# EasyEDA Pro project AD630锁相放大器.eprj

# Schematic Schematic1
Board Name: Board1; Create Date: 2025-03-01; Page Name: P1; Project Name: AD630锁相放大器; Schematic Name: Schematic1; Update Date: 2025-03-07; Company: 嘉立创EDA; Page Size: A4; Version: V1.0
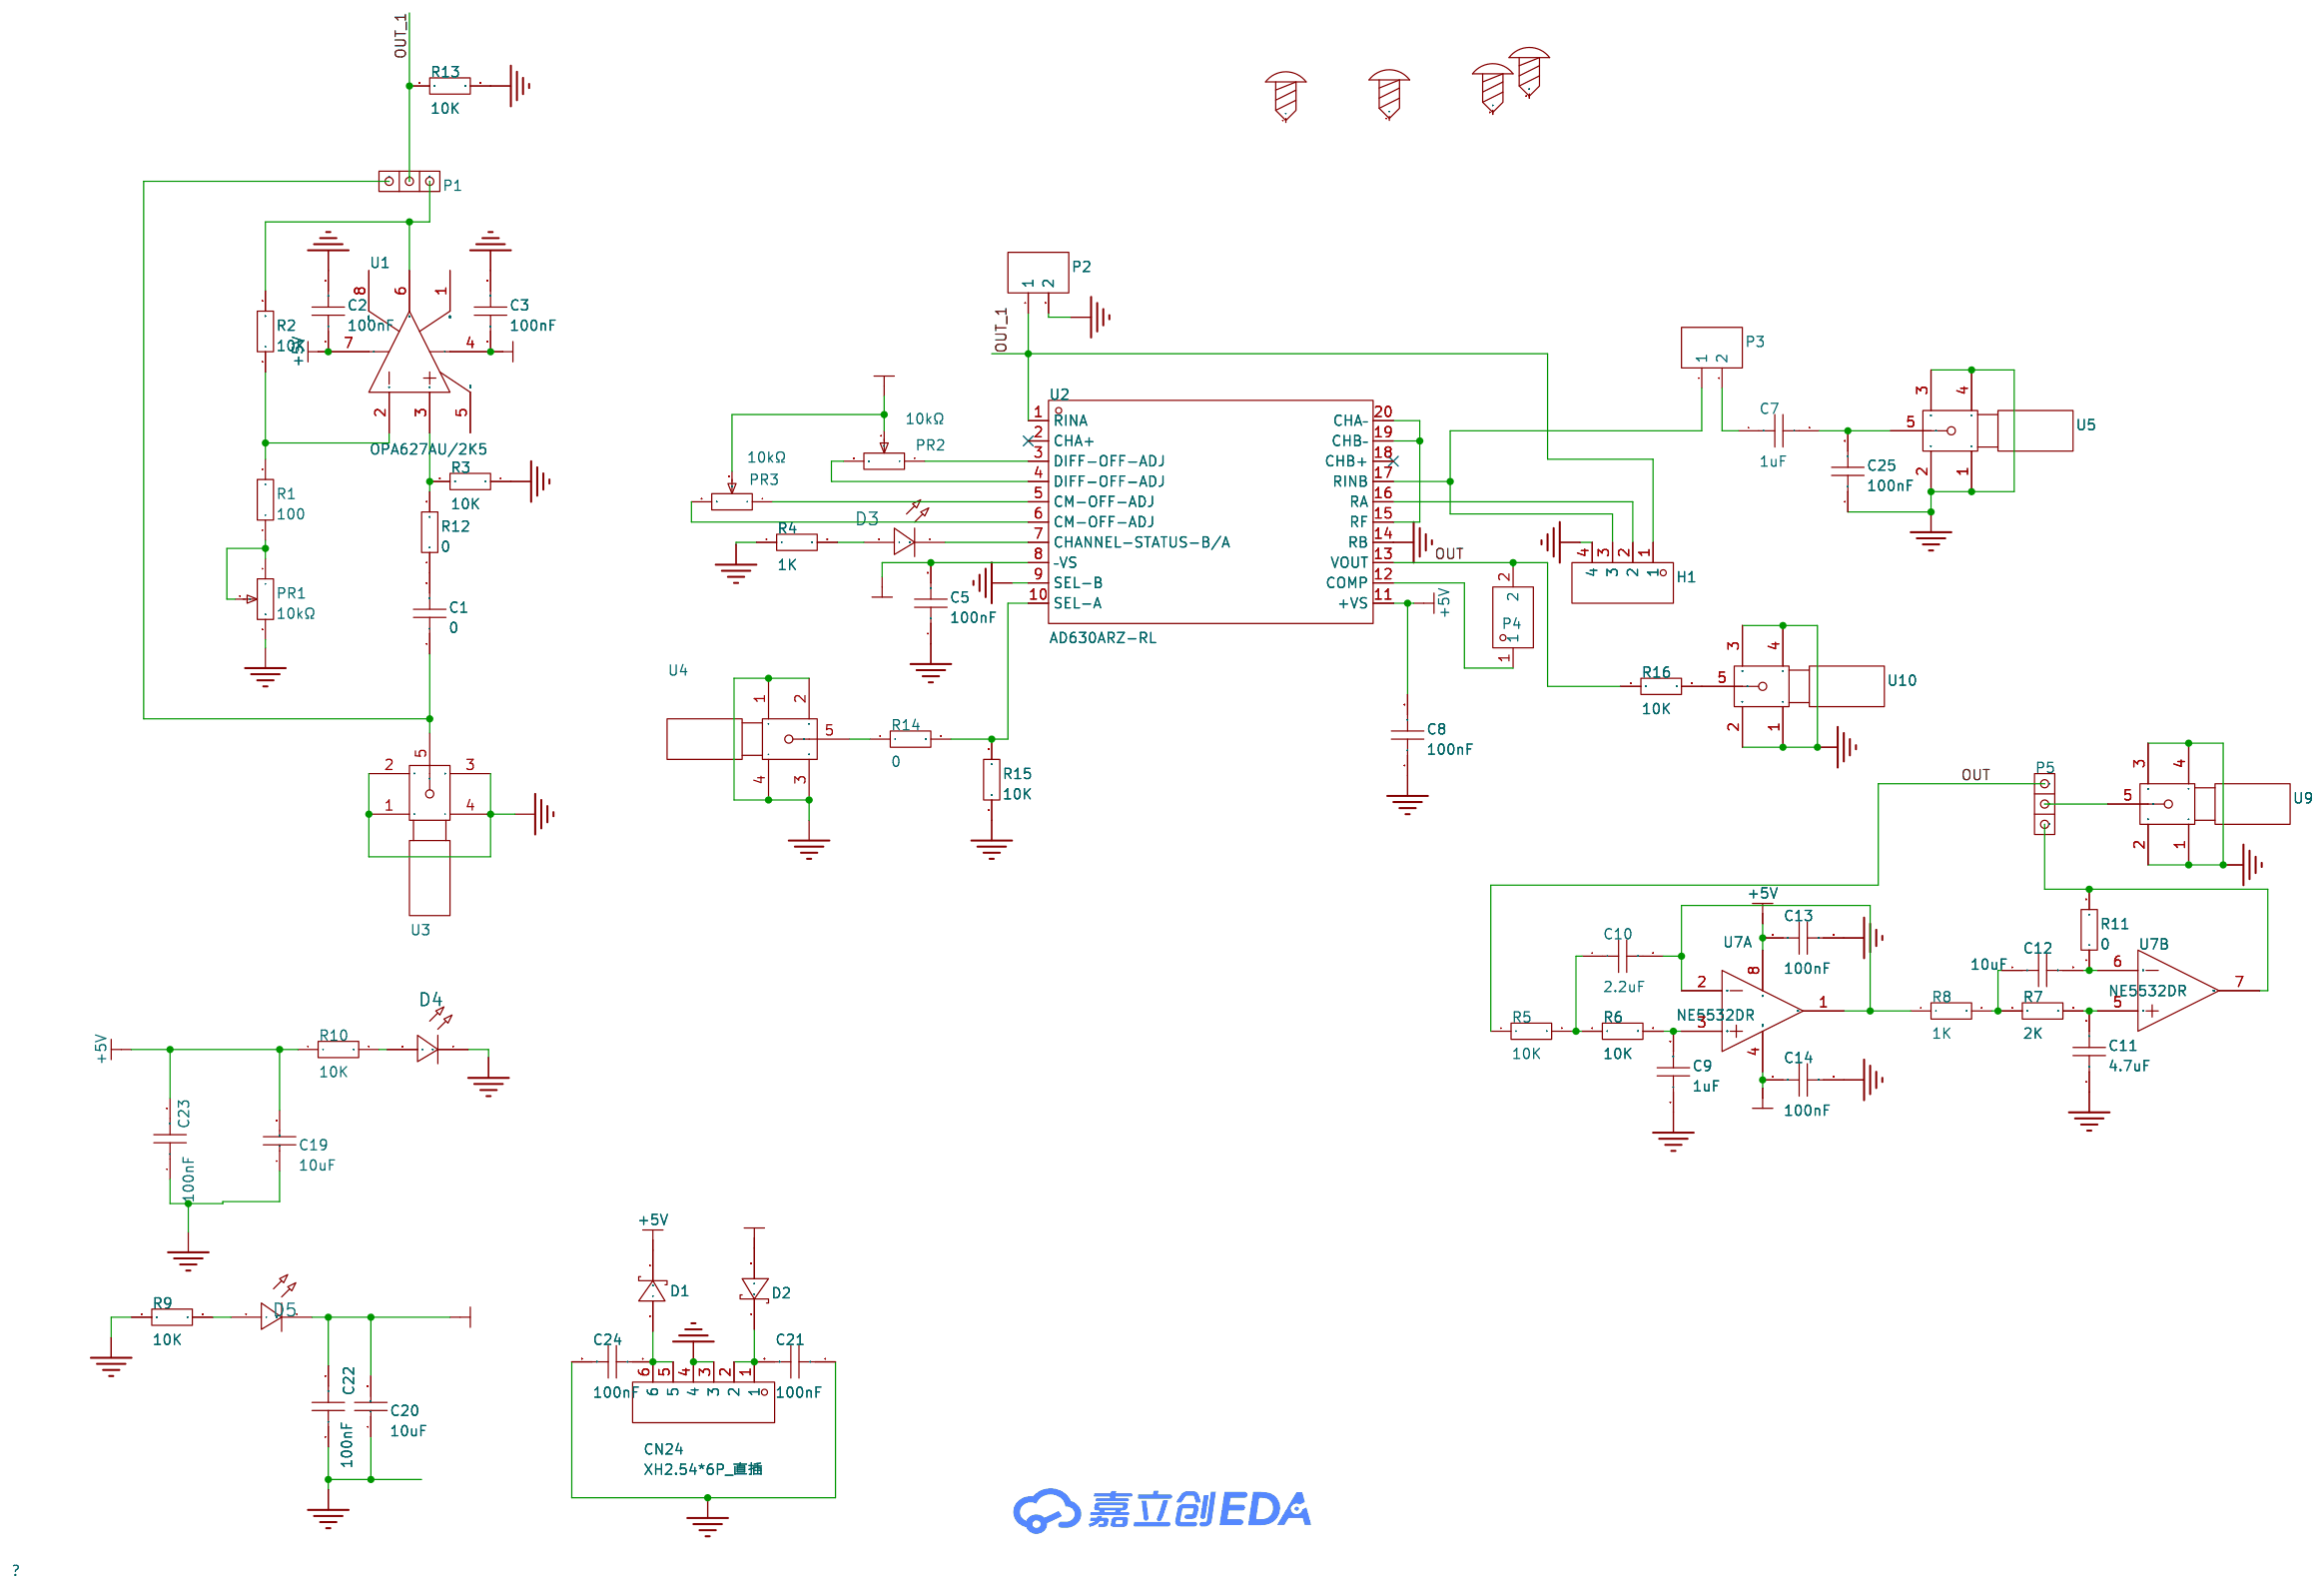
[diagram p0: schematic sheet]

## Parts
C1  0  [R0805]
C2  100nF  [R0805]
C3  100nF  [R0805]
C5  100nF  [R0805]
C7  1uF  [R0805]
C8  100nF  [R0805]
C9  1uF  [R0805]
C10  2.2uF  [R0805]
C11  4.7uF  [R0805]
C12  10uF  [R0805]
C13  100nF  [R0805]
C14  100nF  [R0805]
C19  10uF  [C1210]
C20  10uF  [C1210]
C21  100nF  [R0805]
C22  100nF  [R0805]
C23  100nF  [R0805]
C24  100nF  [R0805]
C25  100nF  [R0805]
CN24  XH2.54*6P_直插  [CONN-TH_XH2.54-6P]
D1  SD103AWS  [SOD-323_L1.8-W1.3-LS2.5-RD]
D2  SD103AWS  [SOD-323_L1.8-W1.3-LS2.5-RD]
D3  -  [LED_0805]
D4  -  [LED_0805]
D5  -  [LED_0805]
H1  -  [HDR-TH_4P-P2.54-V-M]
P1  -  [1*3跳线]
P2  -  [HDR-TH_2P-P2.54-V-F]
P3  -  [HDR-TH_2P-P2.54-V-F]
P4  -  [HDR-TH_2P-P2.54-V-M-2]
P5  -  [1*3跳线]
PR1  10kΩ  [R_3296]
PR2  10kΩ  [R_3296]
PR3  10kΩ  [R_3296]
R1  100  [R0805]
R2  10K  [R0805]
R3  10K  [R0805]
R4  1K  [R0805]
R5  10K  [R0805]
R6  10K  [R0805]
R7  2K  [R0805]
R8  1K  [R0805]
R9  10K  [R0805]
R10  10K  [R0805]
R11  0  [R0805]
R12  0  [R0805]
R13  10K  [R0805]
R14  0  [R0805]
R15  10K  [R0805]
R16  10K  [R0805]
SCREW1  -  [M3螺丝]
SCREW2  -  [M3螺丝]
SCREW3  -  [M3螺丝]
SCREW4  -  [M3螺丝]
U1  OPA627AU/2K5  [SOIC-8_L5.0-W4.0-P1.27-LS6.0-BL]
U2  AD630ARZ-RL  [SOIC-20_L12.8-W7.5-P1.27-LS10.3-BL]
U3  -  [SMA]
U4  -  [SMA]
U5  -  [SMA]
U7  NE5532DR  [SOIC-8_L4.9-W3.9-P1.27-LS6.0-BL]  (sections 1,2)
U9  -  [SMA]
U10  -  [SMA]

## Library data of the parts
C1-C3 C5 C7-C14 C21-C25 = CAP_0805: Supplier Footprint: 0805
C19 C20 = CL32B106KAJNNNE: 容值:10uF;精度:±10%;额定电压:25V;材质(温度系数):X7R;; LCSC Part Name: 10uF ±10% 25V; Supplier Part: C39232; Manufacturer: SAMSUNG(三星); Supplier Footprint: 1210; JLCPCB Part Class: 扩展库; Datasheet: https://atta.szlcsc.com/upload/public/pdf/source/20160218/1457707763339.pdf; Supplier: LCSC; Tolerance: ±10%; Voltage Rated: 25V; Temperature Coefficient: X7R
CN24 = XH2.54*6P_直插: Supplier Part: C9900008614; Supplier Footprint: XH2.54_6P; JLCPCB Part Class: 扩展库; Supplier: LCSC
D1 D2 = SD103AWS_C181207: 正向压降(Vf):600mV@200mA;直流反向耐压(Vr):40V;整流电流:350mA;; LCSC Part Name: 电压:40V 电流:350mA 丝印S4; Supplier Part: C181207; Manufacturer: Hottech(合科泰); Supplier Footprint: SOD-323; JLCPCB Part Class: 扩展库; Datasheet: https://atta.szlcsc.com/upload/public/pdf/source/20240513/4691873FBB9173EFBCF4C6FD4BBA1025.pdf; Supplier: LCSC; Forward Voltage (Vf@If): 600mV@200mA; Reverse Voltage (Vr): 40V; Rectified Current: 350mA
D3-D5 = LED_0805-R: Supplier Footprint: 0805
H1 = HDR-M_2.54_1x4P: Supplier Part: C492403; Supplier Footprint: 插件
P1 P5 = 1*3跳线
P2 P3 = HDR-F_2.54_1x2P: Supplier Part: C49661; Supplier Footprint: 插件
P4 = HDR-M_2.54_2x1: Supplier Part: C2883961; Supplier Footprint: 插件,P=2.54mm
PR1-PR3 = R_3296: Supplier Footprint: 直插
R1-R16 = Res_0805: Supplier Footprint: 0805
SCREW1-SCREW4 = M3螺丝: Supplier Footprint: 插件
U1 = OPA627AU/2K5: Supplier Part: C22061; Manufacturer: TI(德州仪器); Supplier Footprint: SOIC-8; JLCPCB Part Class: 扩展库; Datasheet: https://www.ti.com/cn/lit/gpn/opa627; Supplier: LCSC; Number of Circuits: 单路; Gain Bandwidth Product(GBP): 16MHz; Current - Input Bias(Ib): 2pA; Slew Rate(SR): 55V/us; Output Current: 45mA; Supply Current: 7mA; Operating Temperature: -25℃~+85℃
U2 = AD630ARZ-RL: Supplier Part: C650378; Manufacturer: ADI(亚德诺); Supplier Footprint: SOIC-20-300mil; JLCPCB Part Class: 扩展库; Datasheet: https://atta.szlcsc.com/upload/public/pdf/source/20211124/5F59E476FD89BE9CAFDE745ABADA8C81.pdf; Supplier: LCSC; Gain: 110dB; Supply Voltage: 5V~16.5V; Supply Current: 4mA; Operating Temperature: -25℃~+85℃
U3-U5 U9 U10 = SMA
U7 = NE5532DR: Supplier Part: C7426; Manufacturer: TI(德州仪器); Supplier Footprint: SOIC-8; JLCPCB Part Class: 基础库; Datasheet: http://www.ti.com/cn/lit/gpn/ne5532; Supplier: LCSC; Number of Circuits: 双路; Gain Bandwidth Product(GBP): 10MHz; Current - Input Bias(Ib): 200nA; Slew Rate(SR): 9V/us; Output Current: 38mA; Supply Current: 8mA; Operating Temperature: 0℃~+70℃

## Nets
+5V: C2.1 C8.2 C13.1 C19.2 C23.2 D1.1(C) R10.1 U1.7(V+) U2.11(+VS) U7.8(VCC+)
-5V: C3.1 C5.2 C14.1 C20.2 C22.2 D2.2(A) D5.1(C) PR2.2 PR3.2 U1.4(V-) U2.8(–VS) U7.4(VCC-/GND)
GND: C2.2 C3.2 C5.1 C8.1 C9.1 C11.1 C13.2 C14.2 C19.1 C20.1 C21.1 C22.1 C23.1 C24.2 C25.1 CN24.3 CN24.4 D4.1(C) H1.4 P2.2 PR1.3 R3.1 R4.1 R9.1 R13.2 R15.1 U2.9(SEL-B) U2.14(RB) U3.1 U3.2 U3.3 U3.4 U4.1 U4.2 U4.3 U4.4 U5.1 U5.2 U5.3 U5.4 U9.1 U9.2 U9.3 U9.4 U10.1 U10.2 U10.3 U10.4
OUT: P4.2 P5.1 R5.1 R16.1 U2.13(VOUT)
OUT_1: H1.1 P1.2 P2.1 R13.1 U2.1(RINA)
$1N1046: R1.2 R2.1 U1.2(IN-)
$1N1102: R3.2 R12.2 U1.3(IN+)
$1N1190: D3.1(C) U2.7(CHANNEL-STATUS-B/A)
$1N1194: D3.2(A) R4.2
$1N1238: R14.1 U4.5
$1N1243: R14.2 R15.2 U2.10(SEL-A)
$1N1535: C7.2 C25.2 U5.5
$1N1621: H1.2 U2.16(RA)
$1N1639: U2.15(RF) U2.19(CHB–) U2.20(CHA–)
$1N2255: C9.2 R6.2 U7.3(IN1+)
$1N2340: C10.2 R8.1 U7.1(OUT1) U7.2(IN1-)
$1N2365: C10.1 R5.2 R6.1
$1N2457: C11.2 R7.2 U7.5(IN2+)
$1N2795: C12.1 R7.1 R8.2
$1N3601: D5.2(A) R9.2
$1N3606: D4.2(A) R10.2
$1N4905: PR1.1 PR1.2 R1.1
$1N5136: PR2.1 U2.3(DIFF-OFF-ADJ)
$1N5139: PR2.3 U2.4(DIFF-OFF-ADJ)
$1N5298: C21.2 CN24.1 CN24.2 D2.1(C)
$1N5299: C24.1 CN24.5 CN24.6 D1.2(A)
$1N5306: PR3.1 U2.5(CM-OFF-ADJ)
$1N5510: PR3.3 U2.6(CM-OFF-ADJ)
$1N5595: C12.2 R11.1 U7.6(IN2-)
$1N6798: C1.2 R12.1
$1N10313: R16.2 U10.5
Net-(C1-1): C1.1 P1.1 U3.5
Net-(C7-1): C7.1 P3.2
Net-(H1-3): H1.3 P3.1 U2.17(RINB)
Net-(P1-3): P1.3 R2.2 U1.6(OUT)
Net-(P4-1): P4.1 U2.12(COMP)
Net-(P5-2): P5.2 U9.5
Net-(P5-3): P5.3 R11.2 U7.7(OUT2)

Not connected (* = marked no-connect by the designer): SCREW1 1; SCREW2 1; SCREW3 1; SCREW4 1; U1 1(Offset Trim) 5(Offset Trim) 8(No Internal Connection); U2 2(CHA+)* 18(CHB+)*

# Board PCB1
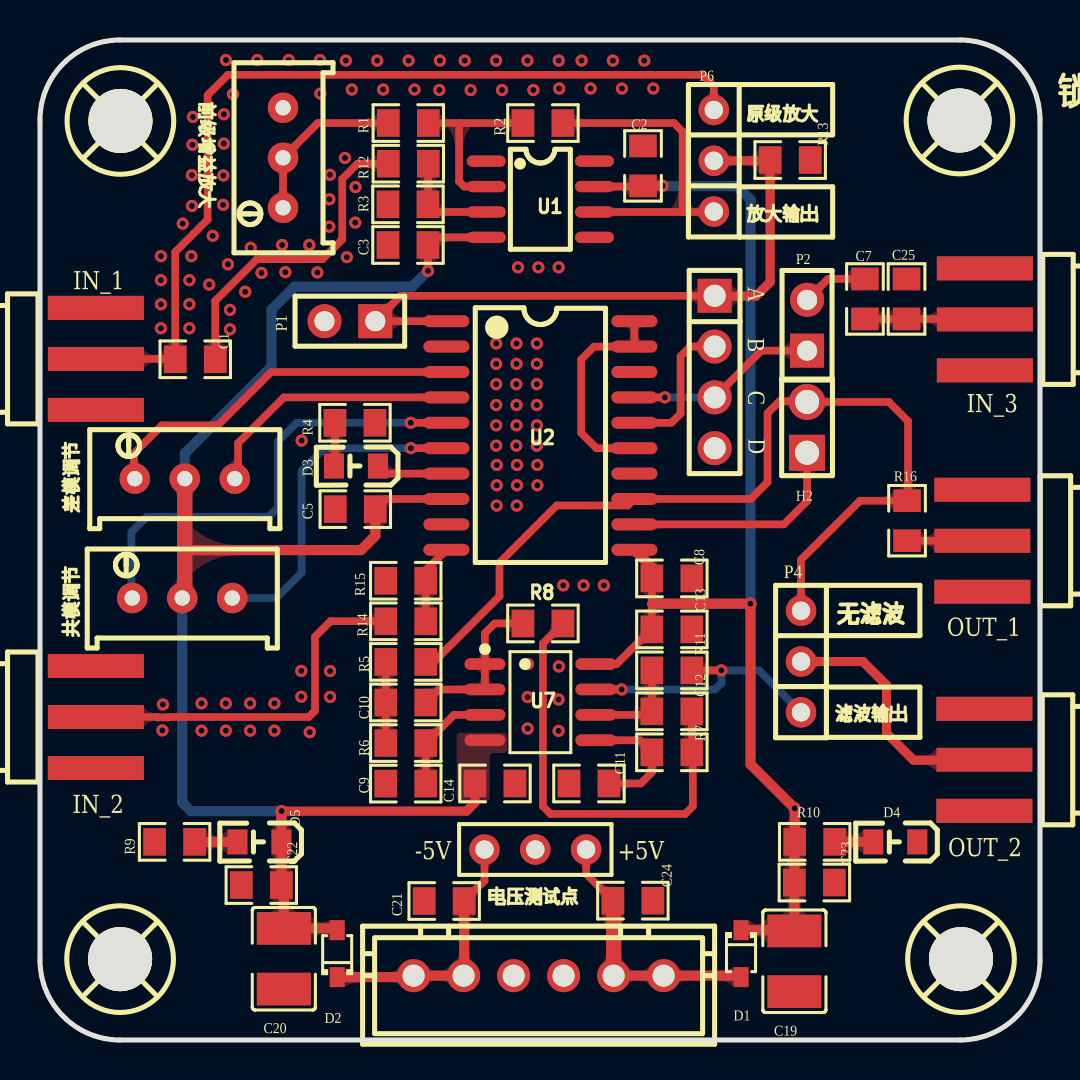
[diagram p1: board, top side]
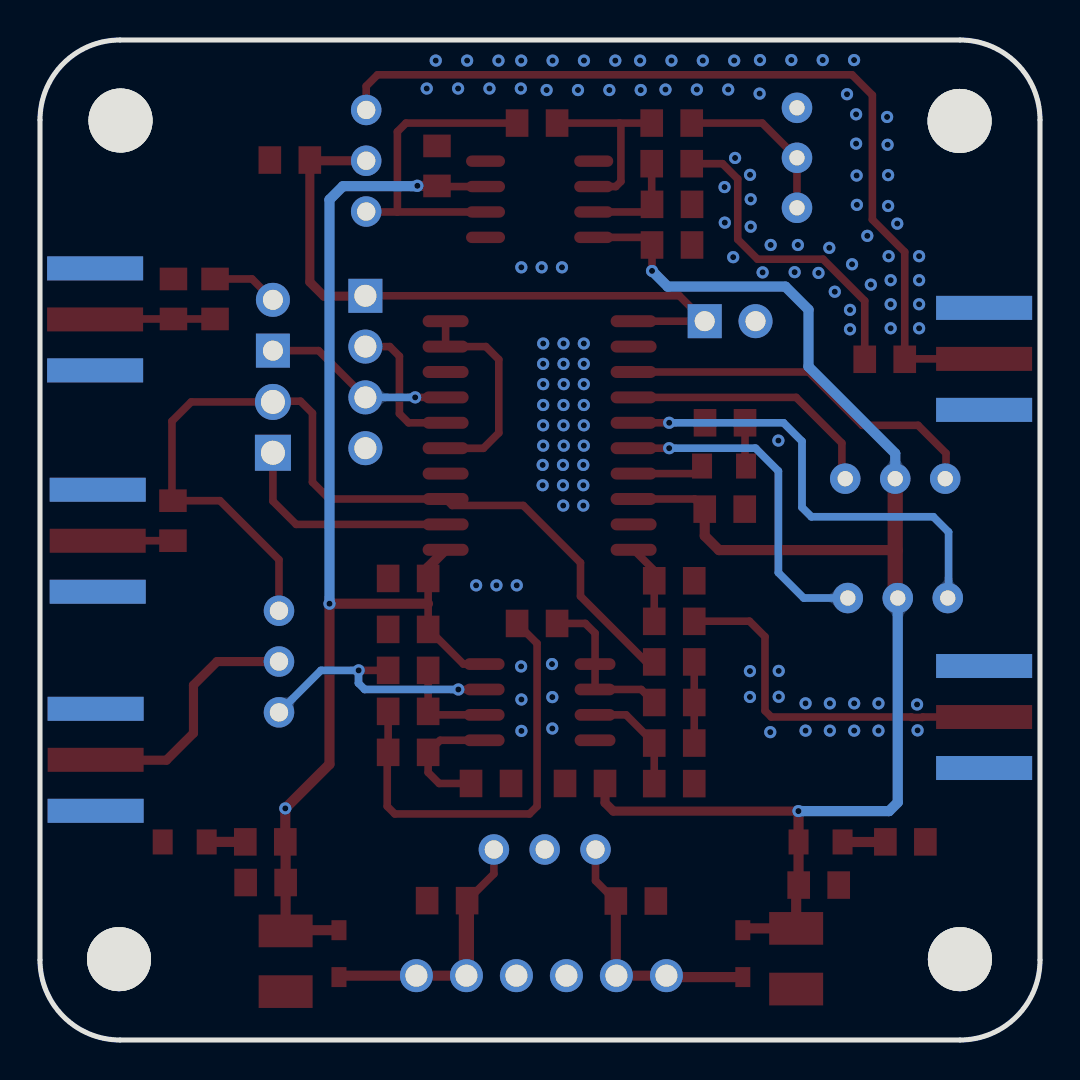
[diagram p2: board, bottom side, seen from below]

Outline 50 x 50 mm; copper layers: Top Layer, Bottom Layer. Coordinates in mm from the lower left corner of the outline.
Outline path: 0,46 0,4 arc(1.17,1.17) 4,0 46,0 arc(48.83,1.17) 50,4 50,46 arc(48.83,48.83) 46,50 4,50 arc(1.17,48.83) 0,46
Stack: Top Layer 0.035mm / Dielectric1 1.51mm FR4 er 4.5 / Bottom Layer 0.035mm

## Design rules (mm)
template: 自定义配置
spacing copperThickness1oz (default): track to track 0.102, other pairs 0.152 to 0.3
spacing copperThickness2oz: track to track 0.203, other pairs 0.152 to 0.3
track width copperThickness1oz (default): min 0.127, default 0.381, max 2.54
track width copperThickness2oz: min 0.203, default 0.254, max 2.54
differential pair differentialPair (default): width min 0.127, default 0.254, max 2.54; gap min 0.152, default 0.152
via viaSize (default): diameter min 0.5, default 0.61, max 10; hole min 0.3, default 0.305, max 6.3

## Placement (name value [footprint] x y rotation side)
C1  0  [R0805#2]  7.87 34.04 0 top
C2  100nF  [R0805#2]  30.15 43.81 90 top
C3  100nF  [R0805#2]  18.29 39.75 180 top
C5  100nF  [R0805#2]  15.88 26.54 0 top
C7  1uF  [R0805#2]  41.25 36.94 270 top
C8  100nF  [R0805#2]  31.48 23.08 180 top
C9  1uF  [R0805#2]  18.4 12.82 0 top
C10  2.2uF  [R0805#2]  18.4 16.88 0 top
C11  4.7uF  [R0805#2]  27.56 12.83 0 top
C12  10uF  [R0805#2]  31.48 16.43 180 top
C13  100nF  [R0805#2]  31.7 20.53 0 top
C14  100nF  [R0805#2]  22.86 12.83 0 top
C19  10uF  [C1210]  37.72 3.94 90 top
C20  10uF  [C1210]  12.19 4.06 90 top
C21  100nF  [R0805#2]  20.32 6.95 0 top
C22  100nF  [R0805#2]  11.18 7.75 0 top
C23  100nF  [R0805#2]  38.61 7.87 180 top
C24  100nF  [R0805#2]  29.76 6.97 0 top
C25  100nF  [R0805#2]  43.33 36.94 270 top
CN24  XH2.54*6P_直插  [CONN-TH_XH2.54-6P]  24.93 3.22 0 top
D1  SD103AWS  [SOD-323_L1.8-W1.3-LS2.5-RD]  35.05 4.32 270 top
D2  SD103AWS  [SOD-323_L1.8-W1.3-LS2.5-RD]  14.86 4.32 90 top
D3  -  [LED_0805]  15.75 28.7 180 top
D4  -  [LED_0805]  42.72 9.91 180 top
D5  -  [LED_0805]  10.92 9.91 180 top
H1  -  [HDR-TH_4P-P2.54-V-M]  33.73 33.4 270 top
H2  -  [HDR-TH_2P-P2.54-V-M-2]  38.35 30.63 0 top
NOREF  -  [Pad_e487]  24.76 9.52 0 top
NOREF#2  -  [Pad_e486]  22.22 9.52 0 top
NOREF#3  -  [Pad_e488]  27.31 9.52 0 top
P1  -  [HDR-TH_2P-P2.54-V-F]  15.49 35.94 180 top
P2  -  [HDR-TH_2P-P2.54-V-F]  38.35 35.74 90 top
P4  -  [1*3跳线]  38.05 16.38 0 top
P6  -  [1*3跳线]  33.69 41.42 0 top
PR1  10kΩ  [R_3296]  12.02 44.11 90 top
PR2  10kΩ  [R_3296]  7.24 28.19 0 top
PR3  10kΩ  [R_3296]  7.11 22.22 0 top
R1  100  [R0805]  18.41 45.85 0 top
R2  10K  [R0805]  25.15 45.85 0 top
R3  10K  [R0805]  18.4 41.78 0 top
R4  1K  [R0805]  15.75 30.86 180 top
R5  10K  [R0805]  18.29 18.9 180 top
R6  10K  [R0805]  18.29 14.85 0 top
R7  2K  [R0805]  31.59 14.38 180 top
R8  1K  [R0805]  25.15 20.83 0 top
R9  10K  [R0805]  6.73 9.91 0 top
R10  10K  [R0805]  38.74 9.91 0 top
R11  0  [R0805]  31.59 18.48 0 top
R12  0  [R0805]  18.41 43.81 0 top
R13  10K  [R0805]  37.51 44 0 top
R14  0  [R0805]  18.29 20.93 0 top
R15  10K  [R0805]  18.29 22.96 0 top
R16  10K  [R0805]  43.35 25.97 270 top
SCREW1  -  [M3螺丝]  45.97 45.97 0 top
SCREW2  -  [M3螺丝]  4.02 45.95 0 top
SCREW3  -  [M3螺丝]  46.05 4.04 0 top
SCREW4  -  [M3螺丝]  4 4.04 0 top
U1  OPA627AU/2K5  [SOIC-8_L5.0-W4.0-P1.27-LS6.0-BL]  25.02 42.04 270 top
U2  AD630ARZ-RL  [SOIC-20_L12.8-W7.5-P1.27-LS10.3-BL]  25.02 30.23 270 top
U3  -  [SMA]  -1.02 28.19 0 top
U4  -  [SMA]  -1.02 10.29 0 top
U5  -  [SMA]  51.05 41.89 180 top
U7  NE5532DR  [SOIC-8_L4.9-W3.9-P1.27-LS6.0-BL]  25.02 16.89 270 top
U9  -  [SMA]  51.03 19.87 180 top
U10  -  [SMA]  50.92 30.82 180 top

## Footprints (pads in the part's own frame, mm; a bottom-side part is the same pattern mirrored in y, then rotated)
1*3跳线
  round 1.524 hole 0.914: 1(0,5.08) 2(0,2.54) 3(0,0)
C1210
  rect 1.635x2.7 smd: 1(-1.518,0) 2(1.518,0)
CONN-TH_XH2.54-6P
  round 1.65 hole 1.1: 1(-6.25,0) 2(-3.75,0) 3(-1.25,0) 4(1.25,0) 5(3.75,0) 6(6.25,0)
HDR-TH_2P-P2.54-V-F
  rect 1.7x1.7 hole 1: 1(-1.27,0)
  round 1.7 hole 1: 2(1.27,0)
HDR-TH_2P-P2.54-V-M-2
  rect 1.8x1.8 hole 1.2: 1(0,-1.27)
  round 1.8 hole 1.2: 2(0,1.27)
HDR-TH_4P-P2.54-V-M
  rect 1.7x1.7 hole 1.1: 1(-3.81,0)
  round 1.7 hole 1.1: 2(-1.27,0) 3(1.27,0) 4(3.81,0)
LED_0805
  rect 1x1.25 smd: 1(-1.15,0.005) 2(1.05,0.005)
M3螺丝
  round 3.2 hole 3.2: 1(0,0)
Pad_e486
  round 1.524 hole 0.914: 1(0,0)
Pad_e487
  round 1.524 hole 0.914: 2(0,0)
Pad_e488
  round 1.524 hole 0.914: 3(0,0)
R0805
  rect 1.133x1.377 smd: 1(-1,0) 2(1,0)
R0805#2
  rect 1.133x1.377 smd: 1(-1.111,0) 2(0.889,0)
R_3296
  round 1.524 hole 0.762: 1(-2.499,-0.127) 2(0,-0.127) 3(2.499,-0.127)
SMA
  rect 4.8x1.2 smd: 1(3.81,8.412) 2(3.81,3.312) 5(3.81,5.862)
  rect 4.8x1.2 smd far side: 3(3.81,3.312) 4(3.81,8.412)
SOD-323_L1.8-W1.3-LS2.5-RD
  rect 1x0.75 smd: 1(-1.173,0) 2(1.173,0)
SOIC-8_L4.9-W3.9-P1.27-LS6.0-BL
  oval 0.588x2.045 smd: 1(-1.905,-2.772) 2(-0.635,-2.772) 3(0.635,-2.772) 4(1.905,-2.772) 5(1.905,2.772) 6(0.635,2.772) 7(-0.635,2.772) 8(-1.905,2.772)
SOIC-8_L5.0-W4.0-P1.27-LS6.0-BL
  oval 0.569x1.95 smd: 1(-1.905,-2.705) 2(-0.635,-2.705) 3(0.635,-2.705) 4(1.905,-2.705) 5(1.905,2.705) 6(0.635,2.705) 7(-0.635,2.705) 8(-1.905,2.705)
SOIC-20_L12.8-W7.5-P1.27-LS10.3-BL
  oval 0.6x2.3 smd: 1(-5.715,-4.7) 2(-4.445,-4.7) 3(-3.175,-4.7) 4(-1.905,-4.7) 5(-0.635,-4.7) 6(0.635,-4.7) 7(1.905,-4.7) 8(3.175,-4.7) 9(4.445,-4.7) 10(5.715,-4.7) 11(5.715,4.7) 12(4.445,4.7) 13(3.175,4.7) 14(1.905,4.7) 15(0.635,4.7) 16(-0.635,4.7) 17(-1.905,4.7) 18(-3.175,4.7) 19(-4.445,4.7) 20(-5.715,4.7)

## Nets
+5V: C2.1 C8.2 C13.1 C19.2 C23.2 D1.1 R10.1 U1.7 U2.11 U7.8
-5V: C3.1 C5.2 C14.1 C20.2 C22.2 D2.2 D5.1 PR2.2 PR3.2 U1.4 U2.8 U7.4
GND: C2.2 C3.2 C5.1 C8.1 C9.1 C11.1 C13.2 C14.2 C19.1 C20.1 C21.1 C22.1 C23.1 C24.2 C25.1 CN24.3 CN24.4 D4.1 H1.4 NOREF.2 P1.2 PR1.3 R3.1 R4.1 R9.1 R13.2 R15.1 U2.9 U2.14 U3.1 U3.2 U3.3 U3.4 U4.1 U4.2 U4.3 U4.4 U5.1 U5.2 U5.3 U5.4 U9.1 U9.2 U9.3 U9.4 U10.1 U10.2 U10.3 U10.4
OUT: H2.2 P4.1 R5.1 R16.1 U2.13
OUT_1: H1.1 P1.1 P6.2 R13.1 U2.1
$1N1031: P6.3 R2.2 U1.6
$1N1046: R1.2 R2.1 U1.2
$1N1098: C1.1 P6.1 U3.5
$1N1102: R3.2 R12.2 U1.3
$1N1190: D3.1 U2.7
$1N1194: D3.2 R4.2
$1N1238: R14.1 U4.5
$1N1243: R14.2 R15.2 U2.10
$1N1535: C7.2 C25.2 U5.5
$1N1621: H1.2 U2.16
$1N1639: U2.15 U2.19 U2.20
$1N2255: C9.2 R6.2 U7.3
$1N2340: C10.2 R8.1 U7.1 U7.2
$1N2365: C10.1 R5.2 R6.1
$1N2457: C11.2 R7.2 U7.5
$1N2795: C12.1 R7.1 R8.2
$1N2948: P4.2 U9.5
$1N3601: D5.2 R9.2
$1N3606: D4.2 R10.2
$1N4905: PR1.1 PR1.2 R1.1
$1N5136: PR2.1 U2.3
$1N5139: PR2.3 U2.4
$1N5298: C21.2 CN24.1 CN24.2 D2.1 NOREF#2.1
$1N5299: C24.1 CN24.5 CN24.6 D1.2 NOREF#3.3
$1N5306: PR3.1 U2.5
$1N5510: PR3.3 U2.6
$1N5592: P4.3 R11.2 U7.7
$1N5595: C12.2 R11.1 U7.6
$1N6798: C1.2 R12.1
$1N10032: H1.3 P2.1 U2.17
$1N10079: C7.1 P2.2
$1N10199: H2.1 U2.12
$1N10313: R16.2 U10.5

Pads without a net: SCREW1 1; SCREW2 1; SCREW3 1; SCREW4 1; U1 1 5 8; U2 2 18

## Via types
v1: diameter 0.61, hole 0.305, Top Layer to Bottom Layer, 128 vias

## Routing (per net, layer and track width the routed paths; a pad name or vN(x,y) marks a point on that pad's centre or on a via; arc(x,y) is an arc through that point)
+5V: length 60.2
  Top Layer w0.381: 30.59,22.58 C13.1 30.56,20.53 28.83,18.8 U7.8 ; U1.7 29.7,42.67 29.78,42.75
  Top Layer w0.508: 30.6,21.82 v1(35.53,21.82) 35.53,13.79 v1(37.74,11.58) R10.1 37.72,9.89 C23.2 C19.2 37.68,5.49 D1.1 ; C8.2 30.59,23.64 U2.11 ; v1(31.13,42.71) 31.13,42.7 C2.1
  Bottom Layer w0.508: v1(31.13,42.71) 31.15,42.69 34.85,42.69 35.53,42.02 v1(35.53,21.82)
-5V: length 79
  Top Layer w0.381: v1(19.4,38.45) C3.1 19.78,40.13 U1.4 ; U2.8 17.27,27.05 C5.2
  Top Layer w0.457: 21.75,12.83 21.75,11.86 21.33,11.44 v1(12.08,11.44)
  Top Layer w0.508: D2.2 14.77,5.58 C20.2 12.19,7.62 C22.2 12.07,7.75 D5.1 12.07,11.44 v1(12.08,11.44) ; 7.24,24.47 7.26,24.5 16.05,24.5 16.76,25.21 C5.2
  Top Layer w0.762: PR2.2 7.24,22.22 PR3.2
  Bottom Layer w0.508: v1(19.4,38.45) 18.61,37.67 12.73,37.67 11.58,36.52 11.58,33.67 7.24,29.33 PR2.2 ; v1(12.08,11.44) 7.55,11.44 7.11,11.88 PR3.2
GND:
  vias: v1(6.05,39.19) v1(6.05,37.99) v1(6.05,36.79) v1(6.05,35.59) v1(6.15,16.78) v1(6.12,15.48) v1(7.14,40.82) v1(7.47,37.99) v1(7.47,36.79) v1(7.47,35.59) v1(7.65,46.15) v1(7.62,44.76) v1(7.59,43.24) v1(7.59,41.7) v1(7.57,39.19) v1(8.08,16.83) v1(8.08,15.47) v1(8.46,37.77) v1(8.64,40.21) v1(9.19,46.28) v1(9.19,44.82) v1(9.17,43.22) v1(9.16,41.76) v1(9.3,49) v1(9.29,16.83) v1(9.29,15.47) v1(9.4,38.79) v1(9.5,36.51) v1(9.5,35.53) v1(9.65,47.29) v1(10.26,37.41) v1(10.54,39.61) v1(10.51,16.83) v1(10.51,15.47) v1(10.86,49) v1(11.07,38.35) v1(11.72,16.83) v1(11.72,15.47) v1(12.11,39.75) v1(12.27,38.39) v1(12.43,49) v1(13.08,29.97) v1(13.06,18.45) v1(13.06,17.16) v1(13.47,39.75) v1(13.49,15.39) v1(13.87,38.38) v1(14,49) v1(14.02,47.32) v1(14.5,43.26) v1(14.47,42.04) v1(14.47,40.67) v1(14.5,18.44) v1(14.5,17.15) v1(15.25,44.1) v1(15.29,48.97) v1(15.34,39.14) v1(15.59,47.52) v1(15.77,42.65) v1(15.76,40.87) v1(16.86,48.97) v1(17.16,47.52) v1(18.43,48.97) v1(18.73,47.52) v1(20,48.97) v1(19.96,47.5) v1(21.23,48.97) v1(21.53,47.5) v1(22.8,48.97) v1(22.81,34.82) v1(22.81,33.81) v1(22.81,32.79) v1(22.81,31.75) v1(22.81,30.73) v1(22.81,29.72) v1(22.83,28.75) v1(22.83,27.74) v1(22.83,26.72) v1(23.1,47.5) v1(23.82,34.82) v1(23.82,33.81) v1(23.81,32.79) v1(23.82,31.75) v1(23.82,30.73) v1(23.81,29.72) v1(23.84,26.72) v1(23.9,38.63) v1(23.85,28.75) v1(23.85,27.74) v1(24.37,48.97) v1(24.4,18.8) v1(24.38,17.14) v1(24.38,15.57) v1(24.67,47.5) v1(24.84,34.82) v1(24.84,33.81) v1(24.84,32.79) v1(24.84,31.75) v1(24.84,30.73) v1(24.84,29.72) v1(24.92,38.63) v1(24.87,28.75) v1(24.87,27.74) v1(25.94,48.97) v1(25.93,38.63) v1(25.95,18.68) v1(25.93,17.03) v1(25.93,15.45) v1(25.96,47.57) v1(26.16,22.73) v1(27.08,48.97) v1(27.18,22.73) v1(27.53,47.57) v1(28.19,22.73) v1(28.64,48.97) v1(29.1,47.57) v1(30.21,48.97) v1(30.66,47.57)
OUT: length 46
  Top Layer w0.381: P4.1 38.05,24.02 41,26.97 R16.1 43.4,27.02 43.4,30.94 42.44,31.9 H2.2 38.32,31.94 36.98,31.94 36.38,31.34 36.38,27.89 35.54,27.05 U2.13 29.39,26.73 25.84,26.73 22.98,23.87 22.98,22.19 19.69,18.9 R5.1
OUT_1: length 33.1
  Top Layer w0.381: U2.1 P1.1 18.03,37.21 H1.1
  Top Layer w0.457: H1.1 33.75,37.19 35.8,37.19 36.51,37.9 R13.1 36.47,43.96 P6.2
$1N1031: length 16.6
  Top Layer w0.381: 32.15,41.4 34.07,41.4 34.12,41.35 ; 32.15,41.4 32.13,41.42 32.13,45.41 31.7,45.85 R2.2 ; 32.15,41.4 U1.6
$1N1046: length 9.1
  Top Layer w0.381: 21.03,45.85 R1.2 ; 21.03,45.85 20.96,45.77 20.96,42.93 21.21,42.67 U1.2 ; 21.03,45.85 R2.1
$1N1098: length 45
  Top Layer w0.381: U3.5 6.74,34.06 6.76,34.04 6.76,39.4 8.38,41.02 8.38,47.24 9.4,48.26 33.12,48.26 33.69,47.69 P6.1
$1N1102: length 5.1
  Top Layer w0.381: 19.41,41.8 19.81,41.4 U1.3 ; 19.41,41.8 R3.2 ; 19.41,41.8 R12.2
$1N1190: length 3.6
  Top Layer w0.381: U2.7 17.27,28.32 D3.1
$1N1194: length 2.2
  Top Layer w0.381: D3.2 14.75,28.75 R4.2
$1N1238: length 18.7
  Top Layer w0.381: R14.1 17.28,20.94 14.53,20.94 13.75,20.17 13.75,16.47 13.43,16.15 6.44,16.15 6.42,16.13 5.88,16.13 5.86,16.15 U4.5
$1N1243: length 4
  Top Layer w0.381: U2.10 19.29,23.48 R15.2 R14.2
$1N1535: length 6
  Top Layer w0.381: C7.2 C25.2 47.22,36.05 U5.5
$1N1621: length 7.3
  Top Layer w0.381: H1.2 32.51,34.67 32.03,34.19 32.03,31.32 31.57,30.86 U2.16
$1N1639: length 10.8
  Top Layer w0.381: U2.15 29.71,29.58 27.83,29.58 27.06,30.36 27.06,34.02 27.71,34.67 U2.19 U2.20
$1N2255: length 5.9
  Top Layer w0.381: R6.2 20.7,16.26 22.25,16.26 ; 19.29,12.67 19.29,14.71 19.52,14.48
$1N2340: length 8.1
  Top Layer w0.381: C10.2 19.94,17.53 U7.2 U7.1 22.25,20.34 22.73,20.83 R8.1
$1N2365: length 4.1
  Top Layer w0.381: 17.29,14.71 17.29,18.79
$1N2457: length 6.4
  Top Layer w0.381: C11.2 30.04,12.83 30.59,13.38 R7.2 29.99,14.99 U7.5
$1N2795: length 22.4
  Top Layer w0.381: 32.59,14.6 32.64,14.56 32.64,11.68 32.26,11.3 25.53,11.3 25.15,11.68 25.15,19.83 R8.2 ; 32.59,14.6 R7.1 ; 32.59,14.6 C12.1
$1N2948: length 12.6
  Top Layer w0.457: U9.5 47.2,13.99 43.68,13.99 42.33,15.34 42.33,17.74 41.14,18.92 P4.2
$1N3601: length 2.1
  Top Layer w0.508: D5.2 7.74,9.9 R9.2
$1N3606: length 1.9
  Top Layer w0.508: D4.2 41.66,9.91 R10.2
$1N4905: length 8.5
  Top Layer w0.381: 12.15,41.61 PR1.2 13.89,45.85 R1.1
$1N5136: length 18.6
  Top Layer w0.381: U2.3 11.56,33.4 8.89,30.73 6.1,30.73 4.7,29.34 4.7,28.11 PR2.1
$1N5139: length 13.2
  Top Layer w0.381: U2.4 12.19,32.13 9.91,29.84 9.91,28.23 PR2.3
$1N5298: length 13.1
  Top Layer w0.381: NOREF#2.1 22.22,7.97 C21.2
  Top Layer w0.508: D2.1 18.61,3.15 CN24.1 CN24.2 21.21,3.25 C21.2
$1N5299: length 13.3
  Top Layer w0.381: C24.1 27.31,8.31 NOREF#3.3
  Top Layer w0.508: D1.2 34.98,3.22 CN24.6 CN24.5
  Top Layer w0.762: C24.1 28.68,6.93 CN24.5
$1N5306: length 23.3
  Top Layer w0.381: U2.5 v1(18.54,30.86)
  Bottom Layer w0.381: v1(18.54,30.86) 12.83,30.86 11.9,29.93 11.9,26.63 11.43,26.16 5.34,26.16 4.57,25.4 4.57,22.14 PR3.1
$1N5510: length 16.8
  Top Layer w0.381: v1(18.54,29.59) U2.6
  Bottom Layer w0.381: v1(18.54,29.59) 14.22,29.59 13.08,28.45 13.08,23.37 11.81,22.1 PR3.3
$1N5592: length 13.4
  Top Layer w0.381: U7.7 v1(29.08,17.53) ; R11.2 v1(34.07,18.48)
  Bottom Layer w0.381: v1(29.08,17.53) 33.76,17.53 34.08,17.84 34.08,18.47 v1(34.07,18.48) 35.95,18.48 P4.3
$1N5595: length 4.9
  Top Layer w0.381: R11.1 C12.2 30.42,16.26 27.79,16.26
$1N6798: length 16.2
  Top Layer w0.381: C1.2 8.76,36.96 10.85,39.04 14.12,39.04 15.11,40.03 15.11,43.05 15.88,43.81 R12.1
$1N10032: length 9.6
  Top Layer w0.381: U2.17 v1(31.24,32.13) ; H1.3 36.07,34.47 P2.1
  Bottom Layer w0.381: v1(31.24,32.13) H1.3
$1N10079: length 3.3
  Top Layer w0.381: P2.2 39.4,38.05 C7.1
$1N10199: length 11.5
  Top Layer w0.381: U2.12 37.19,25.78 38.35,26.94 H2.1
$1N10313: length 3.8
  Top Layer w0.381: R16.2 47.11,24.97 47.11,24.96

## Copper pours and planes (outline as drawn; the poured copper is in the pictures)
-5V on Top Layer: 20.83,15.37 23.37,15.37 23.37,11.94 20.83,11.94

Small or netless copper shapes (teardrops, artwork), in the pictures only: 168 on Top Layer, 16 on Bottom Layer

## Text on the board
Bottom Silkscreen Layer: 调制接法： / 连接P1和P3的AB / IN_2输入方波信号 / OUT_1输入正弦波信号 / OUT_2输出信号 | 锁相器接法： / 断开P1、连接P3的BC / IN_2输入参考信号 / OUT_1接地 / OUT_2输出信号
Top Silkscreen Layer: 差模调节 | 共模调节 | 前级增益放大 | A | B | C | D | AD630 / 锁相放大器 | 电压测试点 | 原级放大 | 放大输出 | 滤波输出 | IN_2 | IN_1 | +5V | OUT_1 | OUT_2 | IN_3 | -5V | 无滤波
